# Altium project neon-Demon-2032-revB.PrjPcb
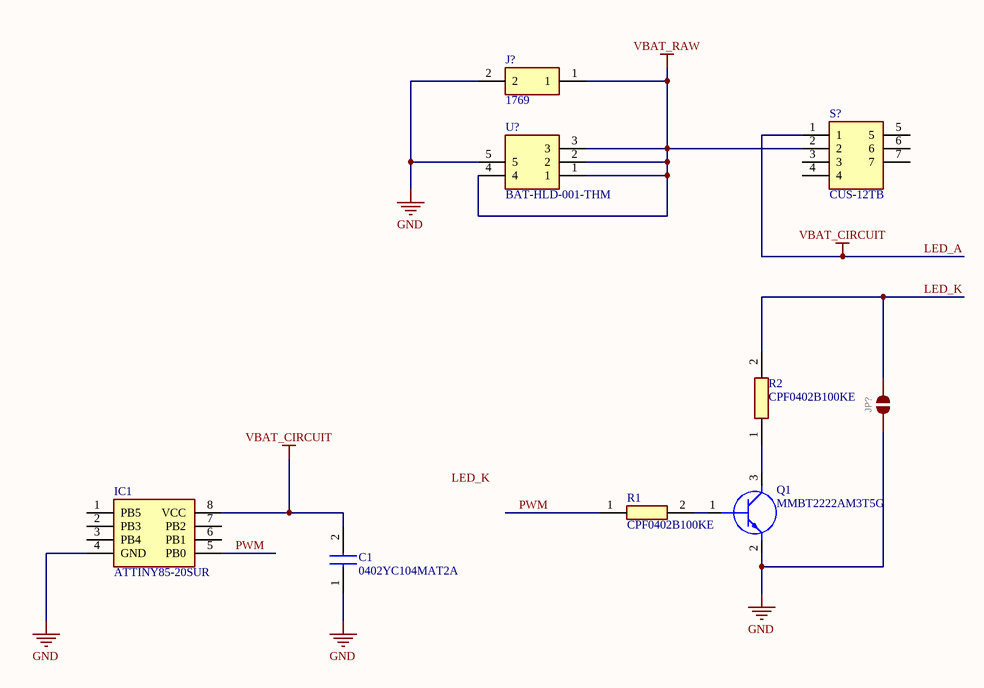
[diagram p0: Neon-Demon-revB.SchDoc]
1 sheet, 9 parts. Net scope: global (net labels, ports and power ports of the same name join across sheets).
Board file: Neon-Demon-revB.PcbDoc

## Sheet Neon-Demon-revB.SchDoc
size A4; SheetNumber: 1; SheetTotal: 1

### Parts
C1  0402YC104MAT2A  [CAPC1005X56N]
IC1  ATTINY85-20SUR  [SOIC127P798X216-8N]
J?  1769  [1769]
JP?  Normally open jumper    This jumper has two pads in close proximity to each other. Apply solder to close the connection.   Round pads are easier to solder for beginners, but are a lot larger.   SparkFun Product that uses the round pads:  SparkFun EL Sequencer  [SMT-JUMPER_2_NO_SILK]  (value not drawn)
Q1  MMBT2222AM3T5G  [SOTFL40P120X55-3N]
R1  CPF0402B100KE  [RESC1005X35N]
R2  CPF0402B100KE  [RESC1005X35N]
S?  CUS-12TB  [CUS-12B]
U?  BAT-HLD-001-THM  [BATHLD001THM]

### Nets
GND: C1.1 IC1.4(GND) J?.2 JP?.1 Q1.2(E) U?.5
LED_A: C1.2 IC1.8(VCC) S?.1  [also labelled VBAT_CIRCUIT]
VBAT_RAW: J?.1 S?.2 U?.1 U?.2 U?.3 U?.4
LED_K: JP?.2 R2.2
PWM: IC1.5(PB0) R1.1
NetQ1_1: Q1.1(B) R1.2
NetQ1_3: Q1.3(C) R2.1

Not connected (* = marked no-connect by the designer): IC1 1(PB5) 2(PB3) 3(PB4) 6(PB1) 7(PB2); S? 3 4 5 6 7

### Notes on the sheet
- Labels drawn without touching a wire or pin: LED_K

### Library data of the parts
C1 = 0402YC104MAT2A: Capacitor; Manufacturer_Name: AVX; Datasheet Link: http://www.mouser.com/catalog/supplier/library/pdf/AVXSurfaceMountCeramic.pdf; Height: 0.56mm; Manufacturer_Part_Number: 0402YC104MAT2A; Mouser Part Number: 581-0402YC104MAT2A; Mouser Price/Stock: https://www.mouser.co.uk/ProductDetail/AVX/0402YC104MAT2A?qs=O2%2FeDh0sX9yiCaLwpXy1bw%3D%3D
IC1 = ATTINY85-20SUR: Integrated Circuit; Manufacturer_Name: Microchip; Datasheet Link: http://ww1.microchip.com/downloads/en/DeviceDoc/Atmel-2586-AVR-8-bit-Microcontroller-ATtiny25-ATtiny45-ATtiny85_Datasheet.pdf; Height: 2.16mm; Manufacturer_Part_Number: ATTINY85-20SUR; Mouser Part Number: 556-ATTINY85-20SUR; Mouser Price/Stock: https://www.mouser.co.uk/ProductDetail/Microchip-Technology/ATTINY85-20SUR?qs=6Dg1WZIWLC6UmR7J9f97hw%3D%3D; Arrow Part Number: ATTINY85-20SUR; Arrow Price/Stock: https://www.arrow.com/en/products/attiny85-20sur/microchip-technology?region=nac
J? = 1769: Connector; Manufacturer_Name: Adafruit; Datasheet Link: https://cdn-shop.adafruit.com/datasheets/17311.pdf; Manufacturer_Part_Number: 1769; Mouser Part Number: 485-1769; Mouser Price/Stock: https://www.mouser.co.uk/ProductDetail/Adafruit/1769?qs=GURawfaeGuBbgoGtf2XstA%3D%3D; Arrow Part Number: 1769; Arrow Price/Stock: https://www.arrow.com/en/products/1769/adafruit-industries?region=nac
JP? = JUMPER-SMT_2_NO_SILK: GateName_1: G$1; SymbolName_1: SMT-JUMPER_2_NO; DeviceName: _SILK; LibraryName: SparkFun-Jumpers; DeviceSetName: JUMPER-SMT_2_NO; Package: SMT-JUMPER_2_NO_SILK
Q1 = MMBT2222AM3T5G: Transistor BJT NPN; Manufacturer_Name: onsemi; Datasheet Link: http://www.onsemi.com/pub/Collateral/MMBT2222AM3-D.PDF; Height: 0.55mm; Manufacturer_Part_Number: MMBT2222AM3T5G; Mouser Part Number: 863-MMBT2222AM3T5G; Mouser Price/Stock: https://www.mouser.co.uk/ProductDetail/onsemi/MMBT2222AM3T5G?qs=N5dOQkml4H%252BwlTOlL9%2F4UA%3D%3D; Arrow Part Number: MMBT2222AM3T5G; Arrow Price/Stock: https://www.arrow.com/en/products/mmbt2222am3t5g/on-semiconductor?region=nac
R1 R2 = CPF0402B100KE: Resistor; Manufacturer_Name: TE Connectivity; Datasheet Link: http://www.farnell.com/datasheets/1786775.pdf; Height: 0.35mm; Manufacturer_Part_Number: CPF0402B100KE; Mouser Part Number: 279-CPF0402B100KE; Mouser Price/Stock: https://www.mouser.co.uk/ProductDetail/TE-Connectivity-Holsworthy/CPF0402B100KE?qs=CXI0wBT1M2h4W2Gm72yIGA%3D%3D; Arrow Part Number: CPF0402B100KE; Arrow Price/Stock: https://www.arrow.com/en/products/cpf0402b100ke/te-connectivity?region=nac
S? = CUS-12TB: Switch; Manufacturer_Name: Copal Electronics; Datasheet Link: http://www.nidec-copal-electronics.com/e/catalog/switch/cus.pdf; Manufacturer_Part_Number: CUS-12TB
U? = BAT-HLD-001-THM: Undefined or Miscellaneous; Manufacturer_Name: Linx Technologies; Datasheet Link: http://www.mouser.com/datasheet/2/238/BAT-HLD-001-THM Diagram-1175214.pdf; Height: 4.2mm; Manufacturer_Part_Number: BAT-HLD-001-THM; Mouser Part Number: 712-BAT-HLD-001-THM; Mouser Price/Stock: https://www.mouser.co.uk/ProductDetail/Linx-Technologies/BAT-HLD-001-THM?qs=Z0V%2FpEl%252BOGcluj3h2QTrDw%3D%3D